# EAGLE schematic 4portHub (EAGLE 9.6.2)
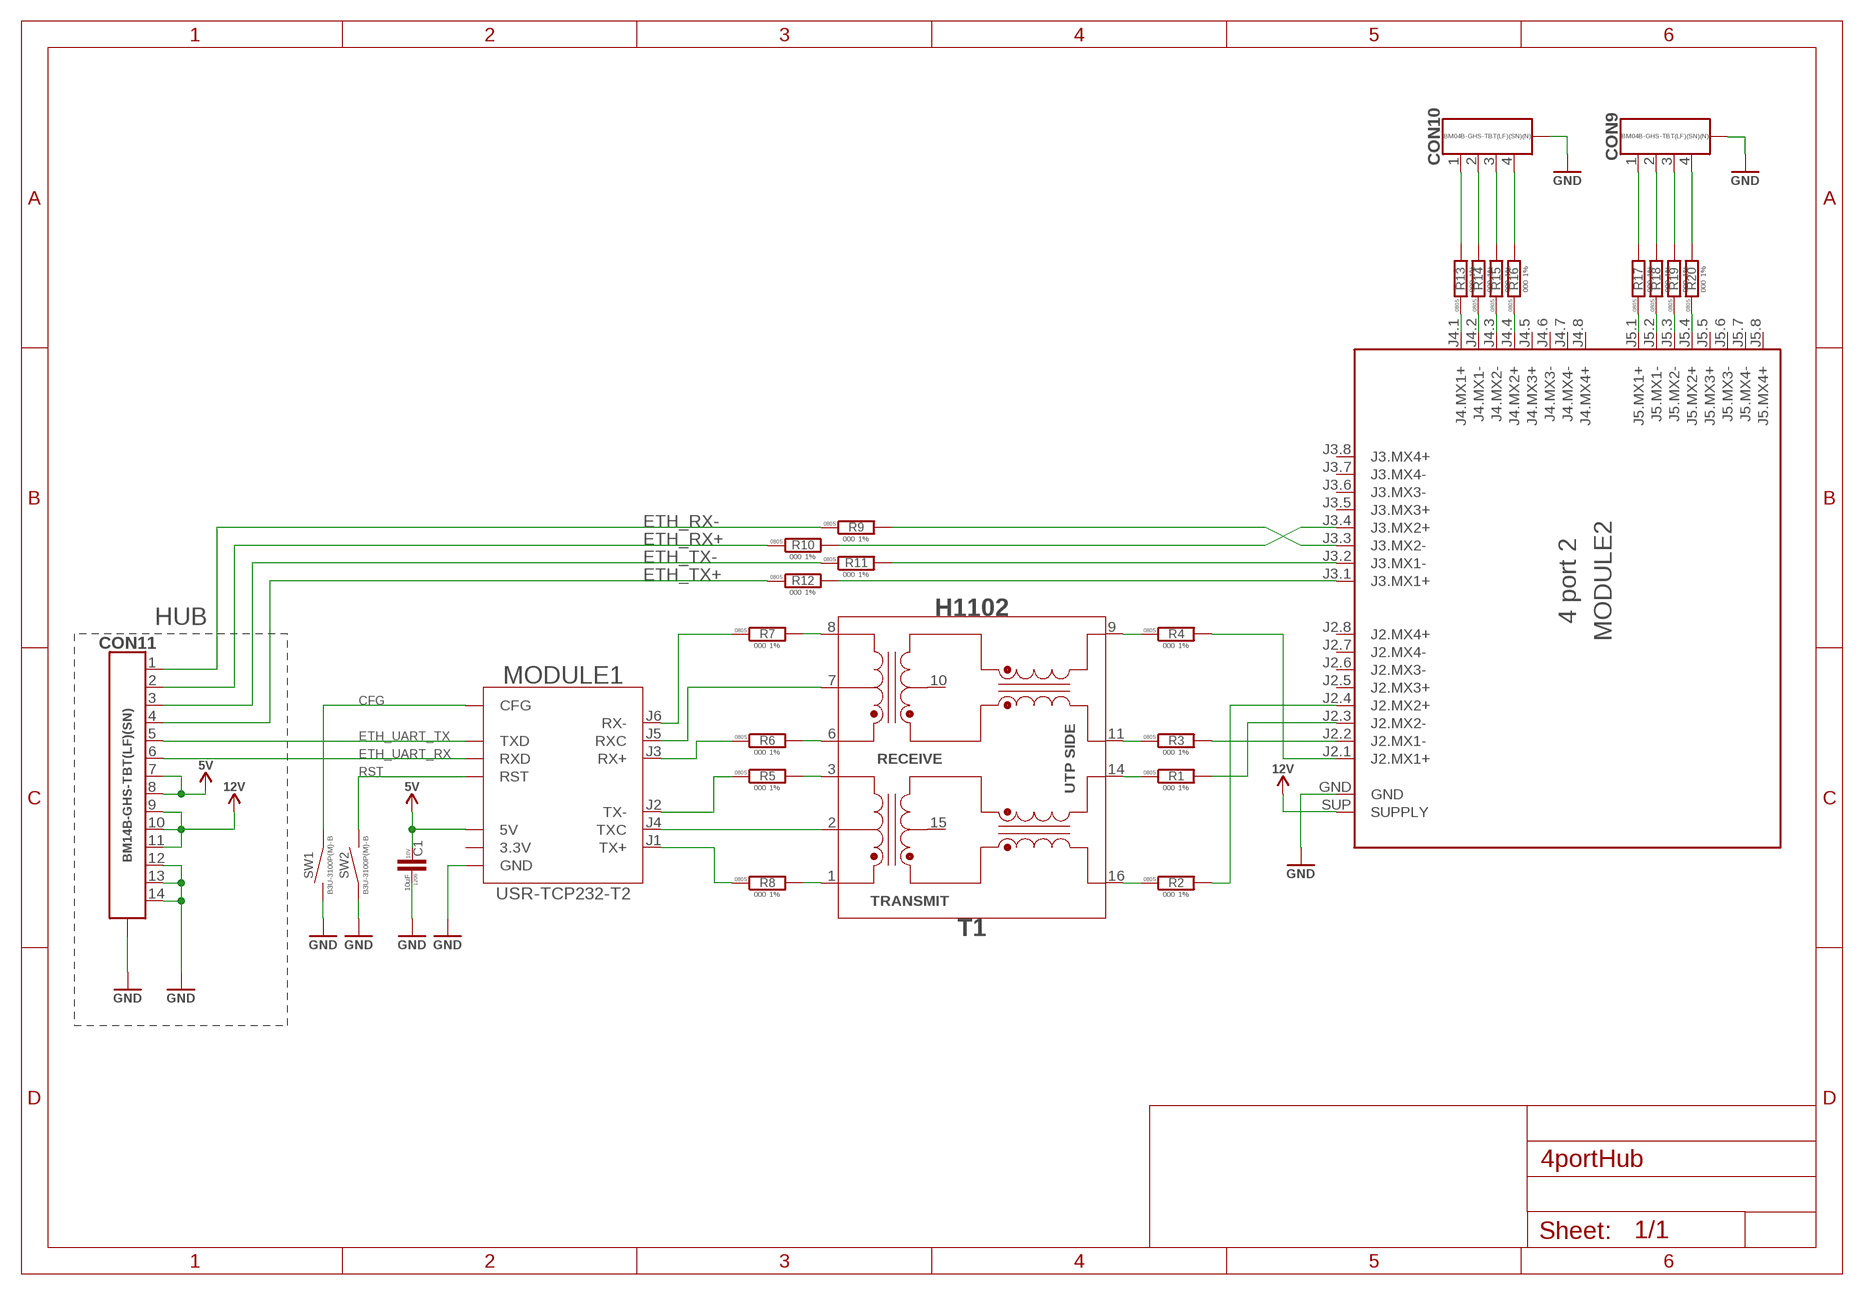
[diagram p0: schematic, sheet 1]

## Parts
C1  10uF  C-1206  [C1206]
CON9  CON-4P-TABS-JST-GH-TOP  [BM04B-GHS-TB]
CON10  CON-4P-TABS-JST-GH-TOP  [BM04B-GHS-TB]
CON11  CON-14P-TABS-JST-GH-TOP  [BM14B-GHS-TBT]
MODULE1  USR-TCP232-T2  [USR-TCP232-T2]
MODULE2  ANDDEAR_4PORT2  [ANDDEAR_4PORT2]
R1  000  R-1%-0805  [R0805]
R2  000  R-1%-0805  [R0805]
R3  000  R-1%-0805  [R0805]
R4  000  R-1%-0805  [R0805]
R5  000  R-1%-0805  [R0805]
R6  000  R-1%-0805  [R0805]
R7  000  R-1%-0805  [R0805]
R8  000  R-1%-0805  [R0805]
R9  000  R-1%-0805  [R0805]
R10  000  R-1%-0805  [R0805]
R11  000  R-1%-0805  [R0805]
R12  000  R-1%-0805  [R0805]
R13  000  R-1%-0805  [R0805]
R14  000  R-1%-0805  [R0805]
R15  000  R-1%-0805  [R0805]
R16  000  R-1%-0805  [R0805]
R17  000  R-1%-0805  [R0805]
R18  000  R-1%-0805  [R0805]
R19  000  R-1%-0805  [R0805]
R20  000  R-1%-0805  [R0805]
SW1  TACT_SWITCH-B3U-3100P(M)-B  [B3U-3100P(M)-B]
SW2  TACT_SWITCH-B3U-3100P(M)-B  [B3U-3100P(M)-B]
T1  H1102NL  [H1102]

## Nets
CFG: MODULE1.CFG SW1.P$1
ETH_RX+: CON11.2 R10.1
ETH_RX-: CON11.1 R9.1
ETH_TX+: CON11.4 R12.1
ETH_TX-: CON11.3 R11.1
ETH_UART_RX: CON11.6 MODULE1.RXD
ETH_UART_TX: CON11.5 MODULE1.TXD
GND: C1.P$1 CON9.M$0(GND) CON9.M$1(GND) CON10.M$0(GND) CON10.M$1(GND) CON11.12 CON11.13 CON11.14 CON11.M$0(G1) CON11.M$1(G1) MODULE1.GND MODULE2.GND SW1.P$2 SW2.P$1
N$1: R7.2 T1.8
N$2: R6.2 T1.6
N$3: R5.2 T1.3
N$4: R8.2 T1.1
N$5: R4.1 T1.9
N$6: R3.1 T1.11
N$7: R1.1 T1.14
N$8: R2.1 T1.16
N$9: MODULE2.J2.1(J2.MX1+) R4.2
N$10: MODULE2.J2.2(J2.MX1-) R3.2
N$11: MODULE2.J2.3(J2.MX2-) R1.2
N$12: MODULE2.J2.4(J2.MX2+) R2.2
N$13: MODULE1.J6(RX-) R7.1
N$14: MODULE1.J1(TX+) R8.1
N$15: MODULE1.J2(TX-) R5.1
N$16: MODULE1.J3(RX+) R6.1
N$17: MODULE2.J3.3(J3.MX2-) R9.2
N$18: MODULE2.J3.4(J3.MX2+) R10.2
N$19: MODULE2.J3.2(J3.MX1-) R11.2
N$20: MODULE2.J3.1(J3.MX1+) R12.2
N$21: CON9.1 R17.2
N$22: CON9.2 R18.2
N$23: CON9.3 R19.2
N$24: CON9.4 R20.2
N$25: CON10.1 R13.2
N$26: CON10.2 R14.2
N$27: CON10.3 R15.2
N$28: CON10.4 R16.2
N$29: MODULE2.J4.1(J4.MX1+) R13.1
N$30: MODULE2.J4.2(J4.MX1-) R14.1
N$31: MODULE2.J4.3(J4.MX2-) R15.1
N$32: MODULE2.J4.4(J4.MX2+) R16.1
N$33: MODULE2.J5.1(J5.MX1+) R17.1
N$34: MODULE2.J5.2(J5.MX1-) R18.1
N$35: MODULE2.J5.3(J5.MX2-) R19.1
N$36: MODULE2.J5.4(J5.MX2+) R20.1
N$37: MODULE1.J5(RXC) T1.7
N$38: MODULE1.J4(TXC) T1.2
RST: MODULE1.RST SW2.P$2
VDD_5V: C1.P$2 CON11.7 CON11.8 MODULE1.5V ; supply symbol labelled 5V
VDD_12V: CON11.9 CON11.10 CON11.11 MODULE2.SUP(SUPPLY) ; supply symbol labelled 12V
Unconnected: MODULE1.3.3V MODULE2.J2.5(J2.MX3+) MODULE2.J2.6(J2.MX3-) MODULE2.J2.7(J2.MX4-) MODULE2.J2.8(J2.MX4+) MODULE2.J3.5(J3.MX3+) MODULE2.J3.6(J3.MX3-) MODULE2.J3.7(J3.MX4-) MODULE2.J3.8(J3.MX4+) MODULE2.J4.5(J4.MX3+) MODULE2.J4.6(J4.MX3-) MODULE2.J4.7(J4.MX4-) MODULE2.J4.8(J4.MX4+) MODULE2.J5.5(J5.MX3+) MODULE2.J5.6(J5.MX3-) MODULE2.J5.7(J5.MX4-) MODULE2.J5.8(J5.MX4+) T1.10 T1.15

## Notes on the sheet
- HUB

## Library data of the parts
C1 = rc:C; PACKAGE: 1206; VOLTAGE: 10V
CON9 CON10 = Connectors:CON-4P-TABS: Connector Receptacle 4 Position; DIGIKEY#: 455-1580-2-ND; ENTRY: TOP; LCSC#: C161692; MANF: JST Sales America Inc; MANF#: BM04B-GHS-TBT(LF)(SN)(N); OPERATING_TEMP: -25°C ~ 85°C
CON11 = Connectors:CON-14P-TABS; ENTRY: TOP; LCSC#: C265384; MANF: JST Sales America; MANF#: BM14B-GHS-TBT(LF)(SN)
MODULE1 = ali_modules:USR-TCP232-T2: Ethernet to UART converter; MANF: Waveshare; MANF#: USR-TCP232-T2
MODULE2 = ali_modules:ANDDEAR_4PORT2; MANF: ANDDEAR; MANF#: 4 port 2
R1-R20 = rc:R; PACKAGE: 0805; TOLERANCE: 1%
SW1 SW2 = mechanical:TACT_SWITCH: tact switch; MANF: OMRON; MANF#: B3U-3100P(M)-B
T1 = misc:H1102NL: MODULE XFRMR SGL ETHR LAN 16SOIC; DIGIKEY#: 553-1203-ND; MANF: Pulse Electronics Corporation; MANF#: H1102